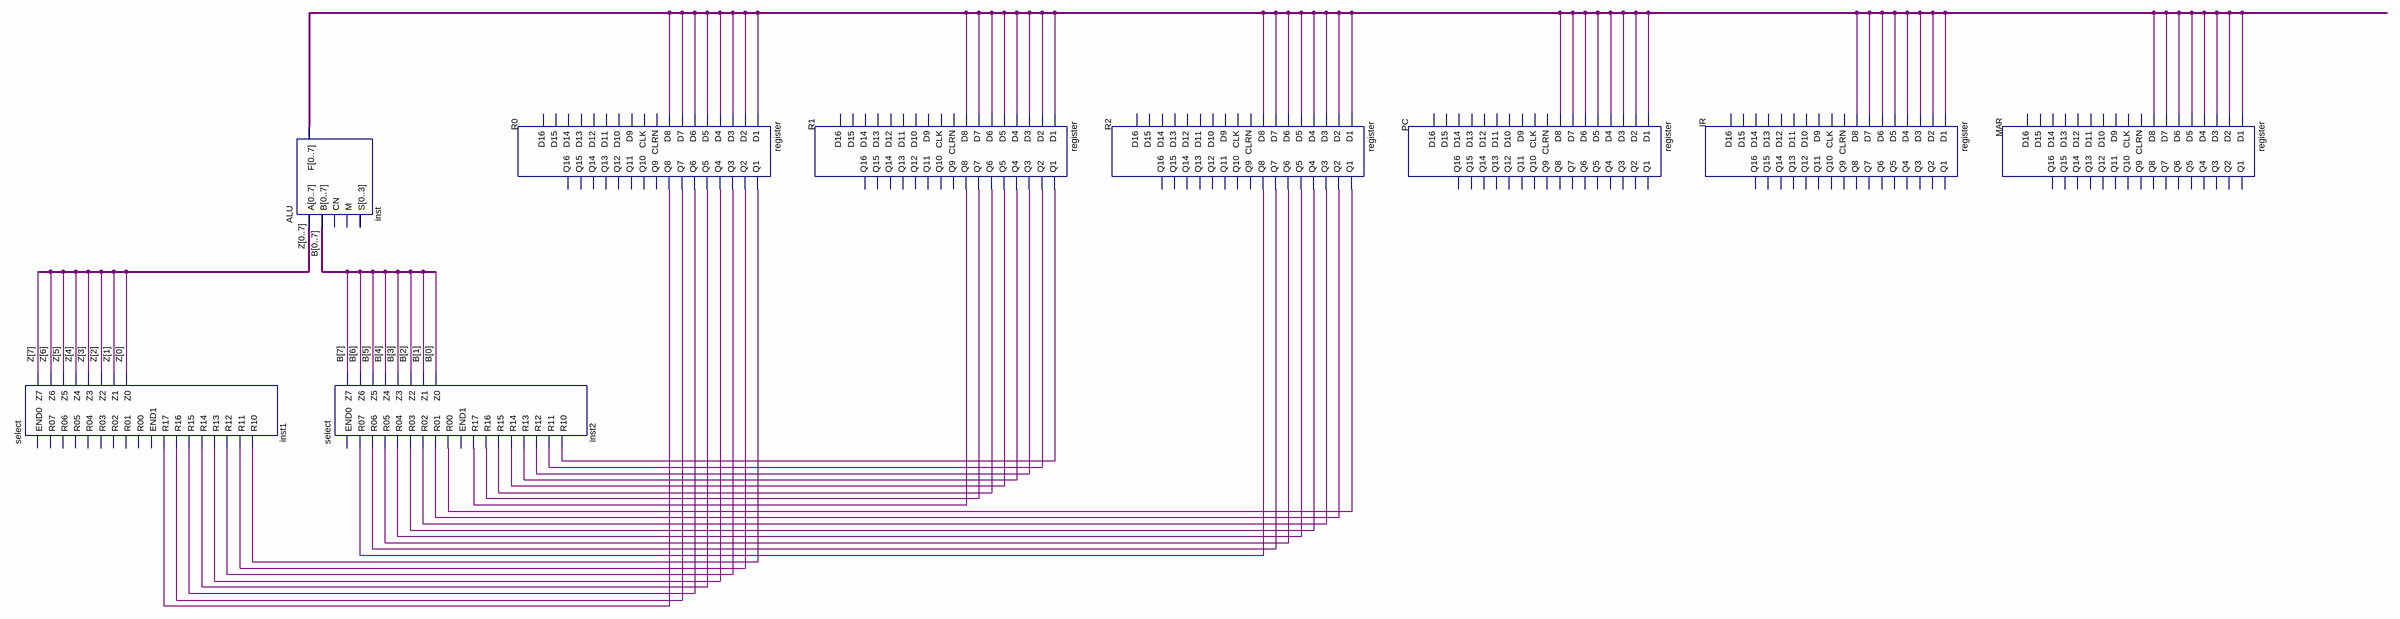
[diagram p0: schematic sheet]
// Quartus schematic Block1.bdf as structural Verilog: 9 symbols, 0 pins
module Block1 (
);

  wire R0_q1, R0_q2, R0_q3, R0_q4, R0_q5, R0_q6, R0_q7, R0_q8, R1_q1, R1_q2, R1_q3, R1_q4, R1_q5, R1_q6,
       R1_q7, R1_q8, R2_q1, R2_q2, R2_q3, R2_q4, R2_q5, R2_q6, R2_q7, R2_q8, undriven, undriven_2,
       undriven_3, undriven_4, undriven_5, undriven_6, undriven_7, undriven_8, undriven_9, undriven_10,
       undriven_11, undriven_12, undriven_13, undriven_14, undriven_15, undriven_16, undriven_17,
       undriven_18, undriven_19, undriven_20, undriven_21, undriven_22, undriven_23, undriven_24,
       undriven_25, undriven_26, undriven_27, undriven_28, undriven_29, undriven_30, undriven_31,
       undriven_32, undriven_33, undriven_34, undriven_35, undriven_36, undriven_37, undriven_38,
       undriven_39, undriven_40, undriven_41, undriven_42, undriven_43, undriven_44, undriven_45,
       undriven_46, undriven_47, undriven_48;
  wire [7:0] B, inst_f, Z;

  select inst1 (
    .R17(R0_q8), .R16(R0_q7), .R15(R0_q6), .R14(R0_q5), .R13(R0_q4), .R12(R0_q3), .R11(R0_q2), .R10(R0_q1),
    .Z7(Z[7]), .Z6(Z[6]), .Z5(Z[5]), .Z4(Z[4]), .Z3(Z[3]), .Z2(Z[2]), .Z1(Z[1]), .Z0(Z[0]));  // open: END0, R07, R06, R05, R04, R03, R02, R01, R00, END1
  ALU inst (
    .A({Z[0], Z[1], Z[2], Z[3], Z[4], Z[5], Z[6], Z[7]}),
    .B({B[0], B[1], B[2], B[3], B[4], B[5], B[6], B[7]}), .F(inst_f));  // open: CN, M, S
  select inst2 (
    .R07(R2_q8), .R06(R2_q7), .R05(R2_q6), .R04(R2_q5), .R03(R2_q4), .R02(R2_q3), .R01(R2_q2), .R00(R2_q1),
    .R17(R1_q8), .R16(R1_q7), .R15(R1_q6), .R14(R1_q5), .R13(R1_q4), .R12(R1_q3), .R11(R1_q2), .R10(R1_q1),
    .Z7(B[7]), .Z6(B[6]), .Z5(B[5]), .Z4(B[4]), .Z3(B[3]), .Z2(B[2]), .Z1(B[1]), .Z0(B[0]));  // open: END0, END1
  register R0 (
    .D1(undriven_8), .D2(undriven_7), .D3(undriven_6), .D4(undriven_5), .D5(undriven_4), .D6(undriven_3),
    .D7(undriven_2), .D8(undriven), .Q1(R0_q1), .Q2(R0_q2), .Q3(R0_q3), .Q4(R0_q4), .Q5(R0_q5), .Q6(R0_q6),
    .Q7(R0_q7), .Q8(R0_q8));  // open: CLRN, CLK, D9, D10, D11, D12, D13, D14, D15, D16, Q9, Q10, Q11, Q12, Q13, Q14, Q15, Q16
  register R1 (
    .D1(undriven_16), .D2(undriven_15), .D3(undriven_14), .D4(undriven_13), .D5(undriven_12),
    .D6(undriven_11), .D7(undriven_10), .D8(undriven_9), .Q1(R1_q1), .Q2(R1_q2), .Q3(R1_q3), .Q4(R1_q4),
    .Q5(R1_q5), .Q6(R1_q6), .Q7(R1_q7), .Q8(R1_q8));  // open: CLRN, CLK, D9, D10, D11, D12, D13, D14, D15, D16, Q9, Q10, Q11, Q12, Q13, Q14, Q15, Q16
  register R2 (
    .D1(undriven_24), .D2(undriven_23), .D3(undriven_22), .D4(undriven_21), .D5(undriven_20),
    .D6(undriven_19), .D7(undriven_18), .D8(undriven_17), .Q1(R2_q1), .Q2(R2_q2), .Q3(R2_q3), .Q4(R2_q4),
    .Q5(R2_q5), .Q6(R2_q6), .Q7(R2_q7), .Q8(R2_q8));  // open: CLRN, CLK, D9, D10, D11, D12, D13, D14, D15, D16, Q9, Q10, Q11, Q12, Q13, Q14, Q15, Q16
  register PC (
    .D1(undriven_25), .D2(undriven_26), .D3(undriven_27), .D4(undriven_28), .D5(undriven_29),
    .D6(undriven_30), .D7(undriven_31), .D8(undriven_32));  // open: CLRN, CLK, D9, D10, D11, D12, D13, D14, D15, D16, Q1, Q2, Q3, Q4, Q5, Q6, Q7, Q8, Q9, Q10, Q11, Q12, Q13, Q14, Q15, Q16
  register IR (
    .D1(undriven_40), .D2(undriven_39), .D3(undriven_38), .D4(undriven_37), .D5(undriven_36),
    .D6(undriven_35), .D7(undriven_34), .D8(undriven_33));  // open: CLRN, CLK, D9, D10, D11, D12, D13, D14, D15, D16, Q1, Q2, Q3, Q4, Q5, Q6, Q7, Q8, Q9, Q10, Q11, Q12, Q13, Q14, Q15, Q16
  register MAR (
    .D1(undriven_41), .D2(undriven_42), .D3(undriven_43), .D4(undriven_44), .D5(undriven_45),
    .D6(undriven_46), .D7(undriven_47), .D8(undriven_48));  // open: CLRN, CLK, D9, D10, D11, D12, D13, D14, D15, D16, Q1, Q2, Q3, Q4, Q5, Q6, Q7, Q8, Q9, Q10, Q11, Q12, Q13, Q14, Q15, Q16
endmodule
